# Altium schematic sheet 扩展板.SchDoc
size A4
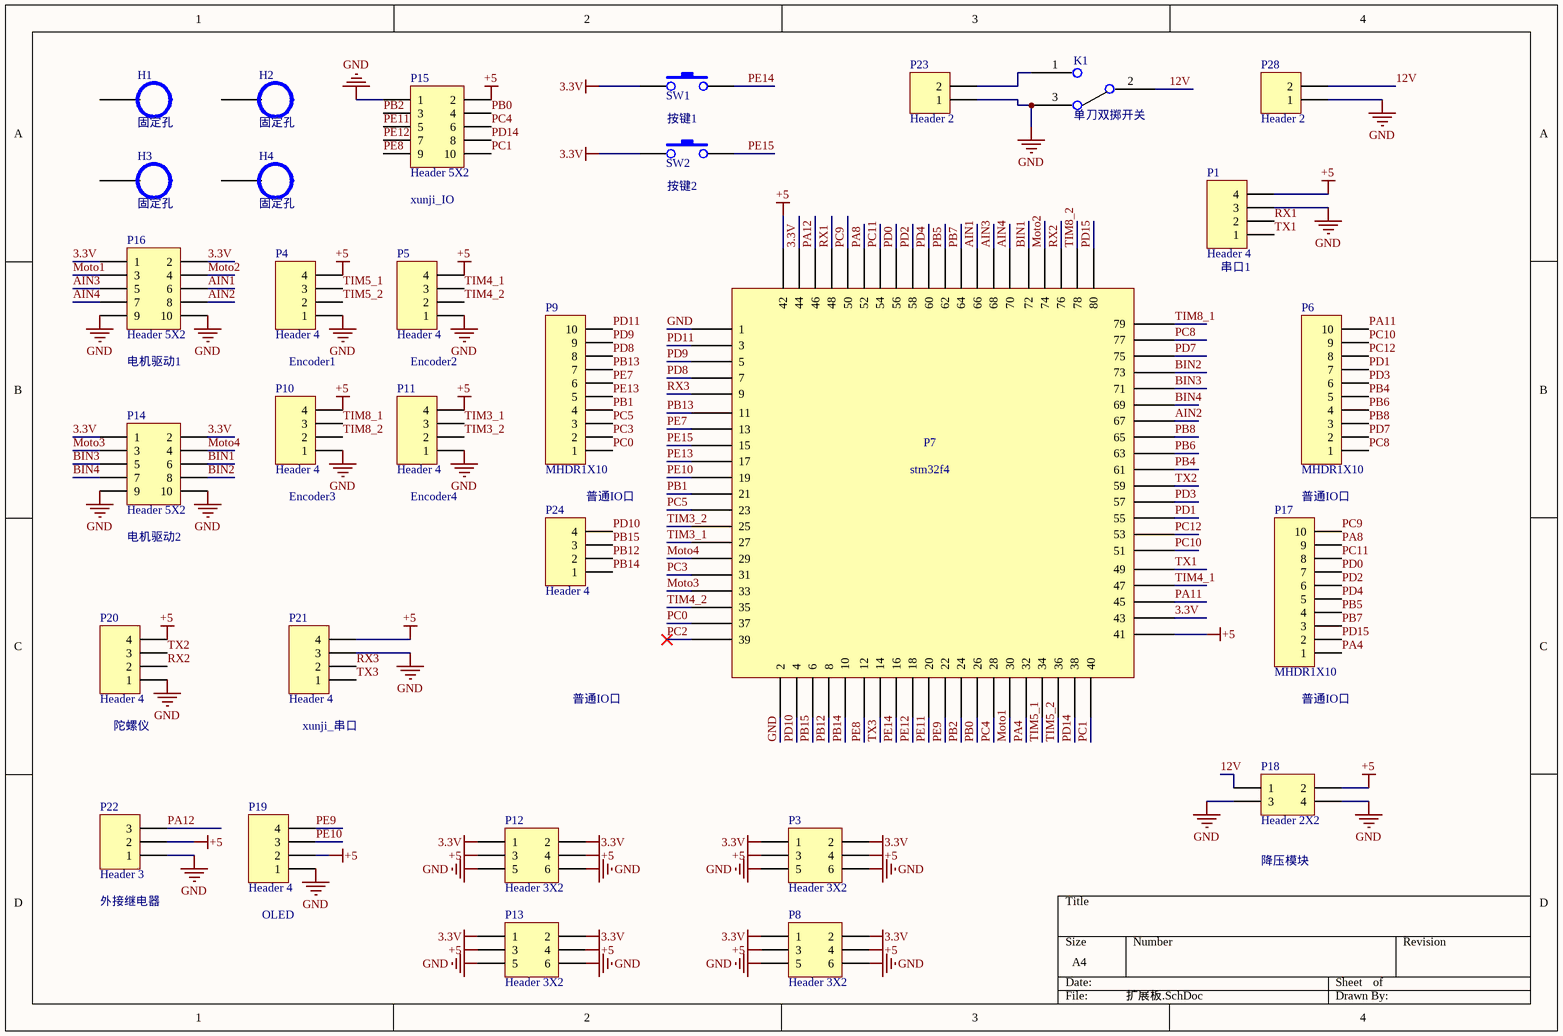
[diagram p0: 扩展板.SchDoc]

## Parts
H1  固定孔  [铜柱孔3]
H2  固定孔  [铜柱孔3]
H3  固定孔  [铜柱孔3]
H4  固定孔  [铜柱孔3]
K1  单刀双掷开关  [SW-TH_SS-12D10L5]
P1  Header 4  [HDR1X4]
P3  Header 3X2  [HDR2X3]
P4  Header 4  [HDR1X4]
P5  Header 4  [HDR1X4]
P6  MHDR1X10  [HDR1X10]
P7  stm32f4  [FK407M1]
P8  Header 3X2  [HDR2X3]
P9  MHDR1X10  [HDR1X10]
P10  Header 4  [HDR1X4]
P11  Header 4  [HDR1X4]
P12  Header 3X2  [HDR2X3]
P13  Header 3X2  [HDR2X3]
P14  Header 5X2  [HDR2X5]
P15  Header 5X2  [HDR2X5]
P16  Header 5X2  [HDR2X5]
P17  MHDR1X10  [HDR1X10]
P18  Header 2X2  [降压模块]
P19  Header 4  [HDR1X4]
P20  Header 4  [HDR1X4]
P21  Header 4  [HDR1X4]
P22  Header 3  [HDR1X3]
P23  Header 2  [CONN-TH_DG127R-5.0-02P-14-00A(H)]
P24  Header 4  [HDR1X4]
P28  Header 2  [CONN-TH_DG127R-5.0-02P-14-00A(H)]
SW1  按键  [KEY]  (value not drawn)
SW2  按键  [KEY]  (value not drawn)

## Nets
3.3V: P3.1 P3.2 P7.43 P7.44 P8.1 P8.2 P12.1 P12.2 P13.1 P13.2 P14.1 P14.2 P16.1 P16.2 SW1.1 SW2.1
+5: P1.4 P3.3 P3.4 P4.4 P5.4 P7.41 P7.42 P8.3 P8.4 P10.4 P11.4 P12.3 P12.4 P13.3 P13.4 P15.2 P18.2 P19.2 P20.4 P21.4 P22.2
GND: K1.3 P1.3 P3.5 P3.6 P4.1 P5.1 P7.1 P7.2 P8.5 P8.6 P10.1 P11.1 P12.5 P12.6 P13.5 P13.6 P14.9 P14.10 P15.1 P16.9 P16.10 P18.3 P18.4 P19.1 P20.1 P21.3 P22.1 P23.1 P28.1
12V: K1.2 P18.1 P28.2
AIN1: P7.66 P16.6
AIN2: P7.67 P16.8
AIN3: P7.68 P16.5
AIN4: P7.70 P16.7
BIN1: P7.72 P14.6
BIN2: P7.73 P14.8
BIN3: P7.71 P14.5
BIN4: P7.69 P14.7
Moto1: P7.30 P16.3
Moto2: P7.74 P16.4
Moto3: P7.33 P14.3
Moto4: P7.29 P14.4
PA4: P7.32 P17.1
PA8: P7.52 P17.9
PA11: P6.10 P7.45
PA12: P7.46 P22.3
PB0: P7.26 P15.4
PB1: P7.21 P9.4
PB2: P7.24 P15.3
PB4: P6.5 P7.61
PB5: P7.62 P17.4
PB6: P6.4 P7.63
PB7: P7.64 P17.3
PB8: P6.3 P7.65
PB12: P7.8 P24.2
PB13: P7.11 P9.7
PB14: P7.10 P24.1
PB15: P7.6 P24.3
PC0: P7.37 P9.1
PC1: P7.40 P15.10
PC2: P7.39
PC3: P7.31 P9.2
PC4: P7.28 P15.6
PC5: P7.23 P9.3
PC8: P6.1 P7.77
PC9: P7.50 P17.10
PC10: P6.9 P7.51
PC11: P7.54 P17.8
PC12: P6.8 P7.53
PD0: P7.56 P17.7
PD1: P6.7 P7.55
PD2: P7.58 P17.6
PD3: P6.6 P7.57
PD4: P7.60 P17.5
PD7: P6.2 P7.75
PD8: P7.7 P9.8
PD9: P7.5 P9.9
PD10: P7.4 P24.4
PD11: P7.3 P9.10
PD14: P7.38 P15.8
PD15: P7.57(80) P17.2
PE7: P7.13 P9.6
PE8: P7.12 P15.9
PE9: P7.22 P19.4
PE10: P7.19 P19.3
PE11: P7.20 P15.5
PE12: P7.18 P15.7
PE13: P7.17 P9.5
PE14: P7.16 SW1.2
PE15: P7.15 SW2.2
RX1: P1.2 P7.48
RX2: P7.76 P20.2
RX3: P7.9 P21.2
TIM3_1: P7.27 P11.3
TIM3_2: P7.25 P11.2
TIM4_1: P5.3 P7.47
TIM4_2: P5.2 P7.35
TIM5_1: P4.3 P7.34
TIM5_2: P4.2 P7.36
TIM8_1: P7.79 P10.3
TIM8_2: P7.78 P10.2
TX1: P1.1 P7.49
TX2: P7.59 P20.3
TX3: P7.14 P21.1
NetK1_1: K1.1 P23.2

Not connected (* = marked no-connect by the designer): H1 11; H2 11; H3 11; H4 11

## Notes on the sheet
- 按键1
- (near P15) xunji_IO
- (near SW2) 按键2
- (near P1) 串口1
- (near P16) 电机驱动1
- Encoder1
- Encoder2
- (near P10) Encoder3
- (near P11) Encoder4
- 普通IO口
- (near P14) 电机驱动2
- (near P17) 普通IO口
- (near P20) 陀螺仪
- (near P21) xunji_串口
- (near P22) 外接继电器
- (near P19) OLED
- 降压模块

## Library data of the parts
P1 P4 P5 P10 P11 P19-P21 P24 = Header 4: Header, 4-Pin; LatestRevisionDate: 17-Jul-2002; LatestRevisionNote: Re-released for DXP Platform.; Publisher: Altium Limited
P3 P8 P12 P13 = Header 3X2: Header, 3-Pin, Dual row; LatestRevisionDate: 17-Jul-2002; LatestRevisionNote: Re-released for DXP Platform.; Publisher: Altium Limited
P6 P9 P17 = MHDR1X10: Header, 10-Pin; LatestRevisionDate: 17-Jul-2002; LatestRevisionNote: Re-released for DXP Platform.; Publisher: Altium Limited
P14-P16 = Header 5X2: Header, 5-Pin, Dual row; LatestRevisionDate: 17-Jul-2002; LatestRevisionNote: Re-released for DXP Platform.; Publisher: Altium Limited
P18 = Header 2X2: Header, 2-Pin, Dual row; LatestRevisionDate: 17-Jul-2002; LatestRevisionNote: Re-released for DXP Platform.; Publisher: Altium Limited
P22 = Header 3: Header, 3-Pin; LatestRevisionDate: 17-Jul-2002; LatestRevisionNote: Re-released for DXP Platform.; Publisher: Altium Limited
P23 P28 = Header 2: Header, 2-Pin; LatestRevisionDate: 17-Jul-2002; LatestRevisionNote: Re-released for DXP Platform.; Publisher: Altium Limited